# Altium project GD_Tcontroller_M.PrjPcb
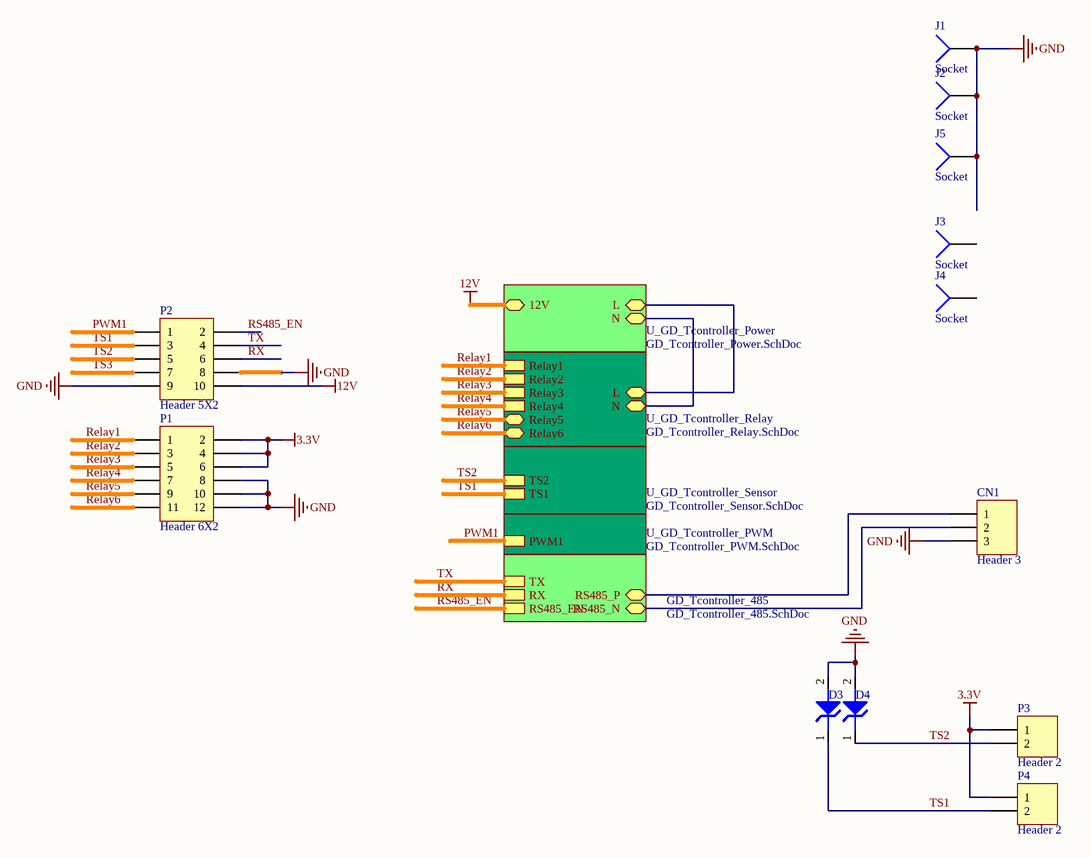
[diagram p0: GD_Tcontroller.SchDoc]
6 sheets, 83 parts. Net scope: hierarchical (ports join the sheet entries above them; power ports are global).
Board file: GD_Tcontroller_M.PcbDoc
Sheets:
  GD_Tcontroller.SchDoc
    GD_Tcontroller_485 = GD_Tcontroller_485.SchDoc
    U_GD_Tcontroller_Sensor = GD_Tcontroller_Sensor.SchDoc
    U_GD_Tcontroller_Relay = GD_Tcontroller_Relay.SchDoc
    U_GD_Tcontroller_PWM = GD_Tcontroller_PWM.SchDoc
    U_GD_Tcontroller_Power = GD_Tcontroller_Power.SchDoc

## Sheet GD_Tcontroller.SchDoc
size A4

### Parts
CN1  Header 3  [HT5.08-3P-H]
D3  SMAJ5.0A  [SMA]  (value not drawn)
D4  SMAJ5.0A  [SMA]  (value not drawn)
J1  Socket  [SCREWFG3_2]
J2  Socket  [SCREWFG3_2]
J3  Socket  [SCREWFG3_2]
J4  Socket  [SCREWFG3_2]
J5  Socket  [SCREWFG3_2]
P1  Header 6X2  [DC3-12P]
P2  Header 5X2  [DC3-10P]
P3  Header 2  [PH2.0-2P-H]
P4  Header 2  [PH2.0-2P-H]

### Sub-sheets
GD_Tcontroller_485 = GD_Tcontroller_485.SchDoc: RS485_EN, TX, RX, RS485_P, RS485_N
U_GD_Tcontroller_Power = GD_Tcontroller_Power.SchDoc: N, L, 12V
U_GD_Tcontroller_PWM = GD_Tcontroller_PWM.SchDoc: PWM1
U_GD_Tcontroller_Relay = GD_Tcontroller_Relay.SchDoc: Relay1, Relay2, Relay3, Relay4, Relay5, Relay6, L, N
U_GD_Tcontroller_Sensor = GD_Tcontroller_Sensor.SchDoc: TS1, TS2

### Nets
3.3V: P1.2 P1.4 P1.6 P3.1 P4.1
12V: P2.10 ; sheet U_GD_Tcontroller_Power/12V
GND: CN1.3 D3.2 D4.2 J1.1 J2.1 J5.1 P1.8 P1.10 P1.12 P2.8 P2.9
L: sheet U_GD_Tcontroller_Relay/L, sheet U_GD_Tcontroller_Power/L
N: sheet U_GD_Tcontroller_Relay/N, sheet U_GD_Tcontroller_Power/N
PWM1: P2.1 ; sheet U_GD_Tcontroller_PWM/PWM1
Relay1: P1.1 ; sheet U_GD_Tcontroller_Relay/Relay1
Relay2: P1.3 ; sheet U_GD_Tcontroller_Relay/Relay2
Relay3: P1.5 ; sheet U_GD_Tcontroller_Relay/Relay3
Relay4: P1.7 ; sheet U_GD_Tcontroller_Relay/Relay4
Relay5: P1.9 ; sheet U_GD_Tcontroller_Relay/Relay5
Relay6: P1.11 ; sheet U_GD_Tcontroller_Relay/Relay6
RS485_EN: P2.2 ; sheet GD_Tcontroller_485/RS485_EN
RS485_N: CN1.2 ; sheet GD_Tcontroller_485/RS485_N
RS485_P: CN1.1 ; sheet GD_Tcontroller_485/RS485_P
RX: P2.6 ; sheet GD_Tcontroller_485/RX
TS1: D3.1 P2.3 P4.2 ; sheet U_GD_Tcontroller_Sensor/TS1
TS2: D4.1 P2.5 P3.2 ; sheet U_GD_Tcontroller_Sensor/TS2
TS3: P2.7
TX: P2.4 ; sheet GD_Tcontroller_485/TX

Not connected (* = marked no-connect by the designer): J3 1; J4 1

### Library data of the parts
CN1 = Header 3: Header, 3-Pin; LatestRevisionDate: 17-Jul-2002; LatestRevisionNote: Re-released for DXP Platform.; Publisher: Altium Limited
D3 D4 = ED00032: Manufacturer P/N: SMBJ15A; Manufacturer: Bourns; P/N: EE00002; Value: SMBJ15A; Type: ****
P1 = Header 6X2: Header, 6-Pin, Dual row; LatestRevisionDate: 17-Jul-2002; LatestRevisionNote: Re-released for DXP Platform.; Publisher: Altium Limited
P2 = Header 5X2: Header, 5-Pin, Dual row; LatestRevisionDate: 17-Jul-2002; LatestRevisionNote: Re-released for DXP Platform.; Publisher: Altium Limited
P3 P4 = Header 2: Header, 2-Pin; LatestRevisionDate: 17-Jul-2002; LatestRevisionNote: Re-released for DXP Platform.; Publisher: Altium Limited
J1-J5 = Socket: LatestRevisionDate: 17-Jul-2002; LatestRevisionNote: Re-released for DXP Platform.; Publisher: Altium Limited

## Sheet GD_Tcontroller_485.SchDoc
size A4
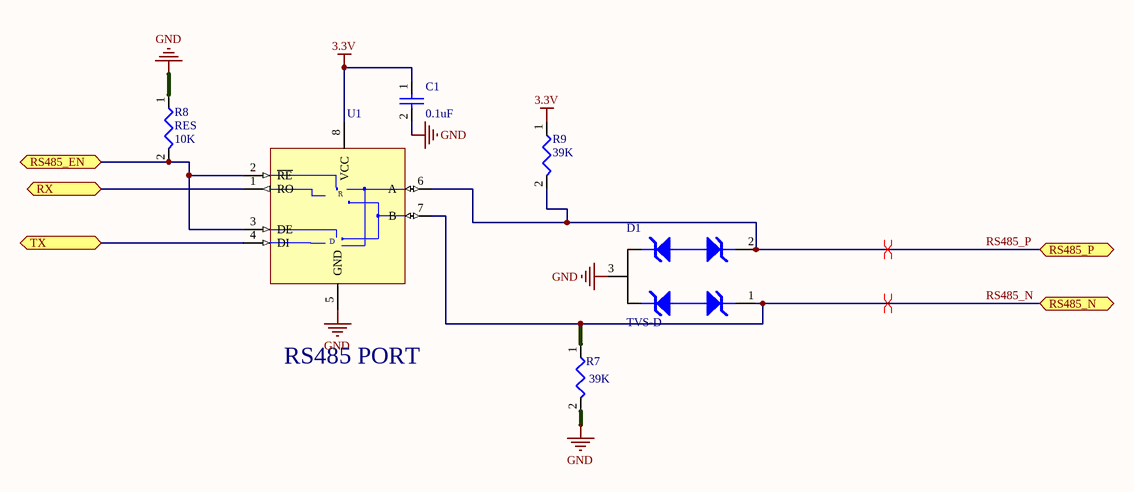
[diagram p1: GD_Tcontroller_485.SchDoc]

### Parts
C1  value 0.1uF  [C0805]  (hidden comment: CAP)
D1  TVS-D  [SOT23-123]
R7  value 39K  [R0805]  (hidden comment: RES)  (no BOM)
R8  RES  value 10K  [R0805]
R9  value 39K  [R0805]  (hidden comment: RES)  (no BOM)
U1  SN65HVD08D  [SOIC8]  (value not drawn)

### Ports
RS485_EN, RS485_N, RS485_P, RX, TX

### Nets
3.3V: C1.1 R9.1 U1.8(VCC)
GND: C1.2 D1.3 R7.2 R8.1 U1.5(GND)
RS485_EN: R8.2 U1.2(~{RE}) U1.3(DE) ; port RS485_EN
RS485_N: D1.1 R7.1 U1.7(B) ; port RS485_N
RS485_P: D1.2 R9.2 U1.6(A) ; port RS485_P
RX: U1.1(RO) ; port RX
TX: U1.4(DI) ; port TX

### Layout directives
differential pair: RS485_N, RS485_P

### Notes on the sheet
- RS485 PORT
- (in symbol EU00041) R; D

### Library data of the parts
C1 = EC00014: CAP SMD CR X7R 50V 10% 0.1uF 0805 ROHS; Manufacturer: YAGEO; Manufacturer P/N: CC0805KRX7R9BB104; ID: 14; HelpURL: *; P/N: EC00014
D1 = ED00007: DIODE TVS 7V 12V 17A 400W SOT-23 SMD ROHS; Manufacturer: BOURNS; ID: 7; Value: CDSOT23-SM712; Type: ****; HelpURL: \\192.168.1.3\Esh\Department\RD\CAD\Component\IO_PROTECTION\BOURNS_CDSOT23-SM712.pdf; P/N: ED00007; Manufacturer P/N: CDSOT23-SM712
R7 R9 = ER00021: RES THICK_FILM SMD 39K 5% 1/8W ROHS 0805; Manufacturer: YAGEO; Manufacturer P/N: RC0805JR-0739KL; ID: 21; HelpURL: *; P/N: ER00021
R8 = ER00213: RES THICK_FILM SMD 10K ohm 5% 1/10W ROHS 0603; Manufacturer: YAGEO; Manufacturer P/N: RC0603JR-1310KL; ID: 213; HelpURL: \\192.168.1.3\Esh\Department\RD\CAD\Component\Resistor\SMD\YAGEO_PYu-RC1206_51_RoHS_L_4.pdf; P/N: ER00213
U1 = EU00041: IC 5V,RS-485,10Mbps,16KV,TRANSCEIVERS,SOIC-8,ROHS; Manufacturer: Texas Instruments; ID: 41; HelpURL: \\192.168.1.3\Esh\Department\RD\CAD\Component\RS485\sn65hvd08.pdf; P/N: EU00041; Manufacturer P/N: SN65HVD08D; Value: SN65HVD08D; Type: *****

## Sheet GD_Tcontroller_Sensor.SchDoc
size A4
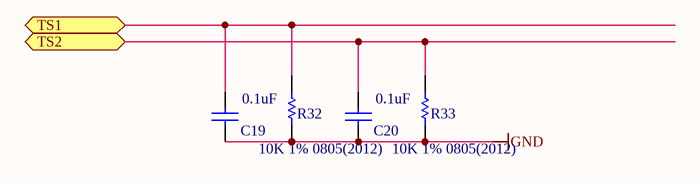
[diagram p2: GD_Tcontroller_Sensor.SchDoc]

### Parts
C19  value 0.1uF  [C0805]  (hidden comment: CAP 0.1uF 50V 0805(2012))
C20  value 0.1uF  [C0805]  (hidden comment: CAP 0.1uF 50V 0805(2012))
R32  10K 1% 0805(2012)  [R0805]  (no BOM)
R33  10K 1% 0805(2012)  [R0805]  (no BOM)

### Ports
TS1, TS2

### Nets
GND: C19.1 C20.1 R32.2 R33.2
TS1: C19.2 R32.1 ; port TS1
TS2: C20.2 R33.1 ; port TS2

### Library data of the parts
C19 C20 = CMP-1036-00070-1: CAP 0.1uF 50V ±20% 0805 (2012 Metric) Thickness 1mm SMD; Case-Metric: 2012; Case-EIA: 0805; Tolerance: 20%; Rated Voltage: 50 V; Technology: SMT; Max Thickness: 1 mm
R32 R33 = CMP-1013-00098-1: 10K 0.125W 5% 0805 (2012 Metric)  SMD; Case-EIA: 0805; Case-Metric: 2012; Value: 10000.00 Ohm; Power: 0.125 W; Technology: SMT; Tolerance: 1 %

## Sheet GD_Tcontroller_Relay.SchDoc
size A3
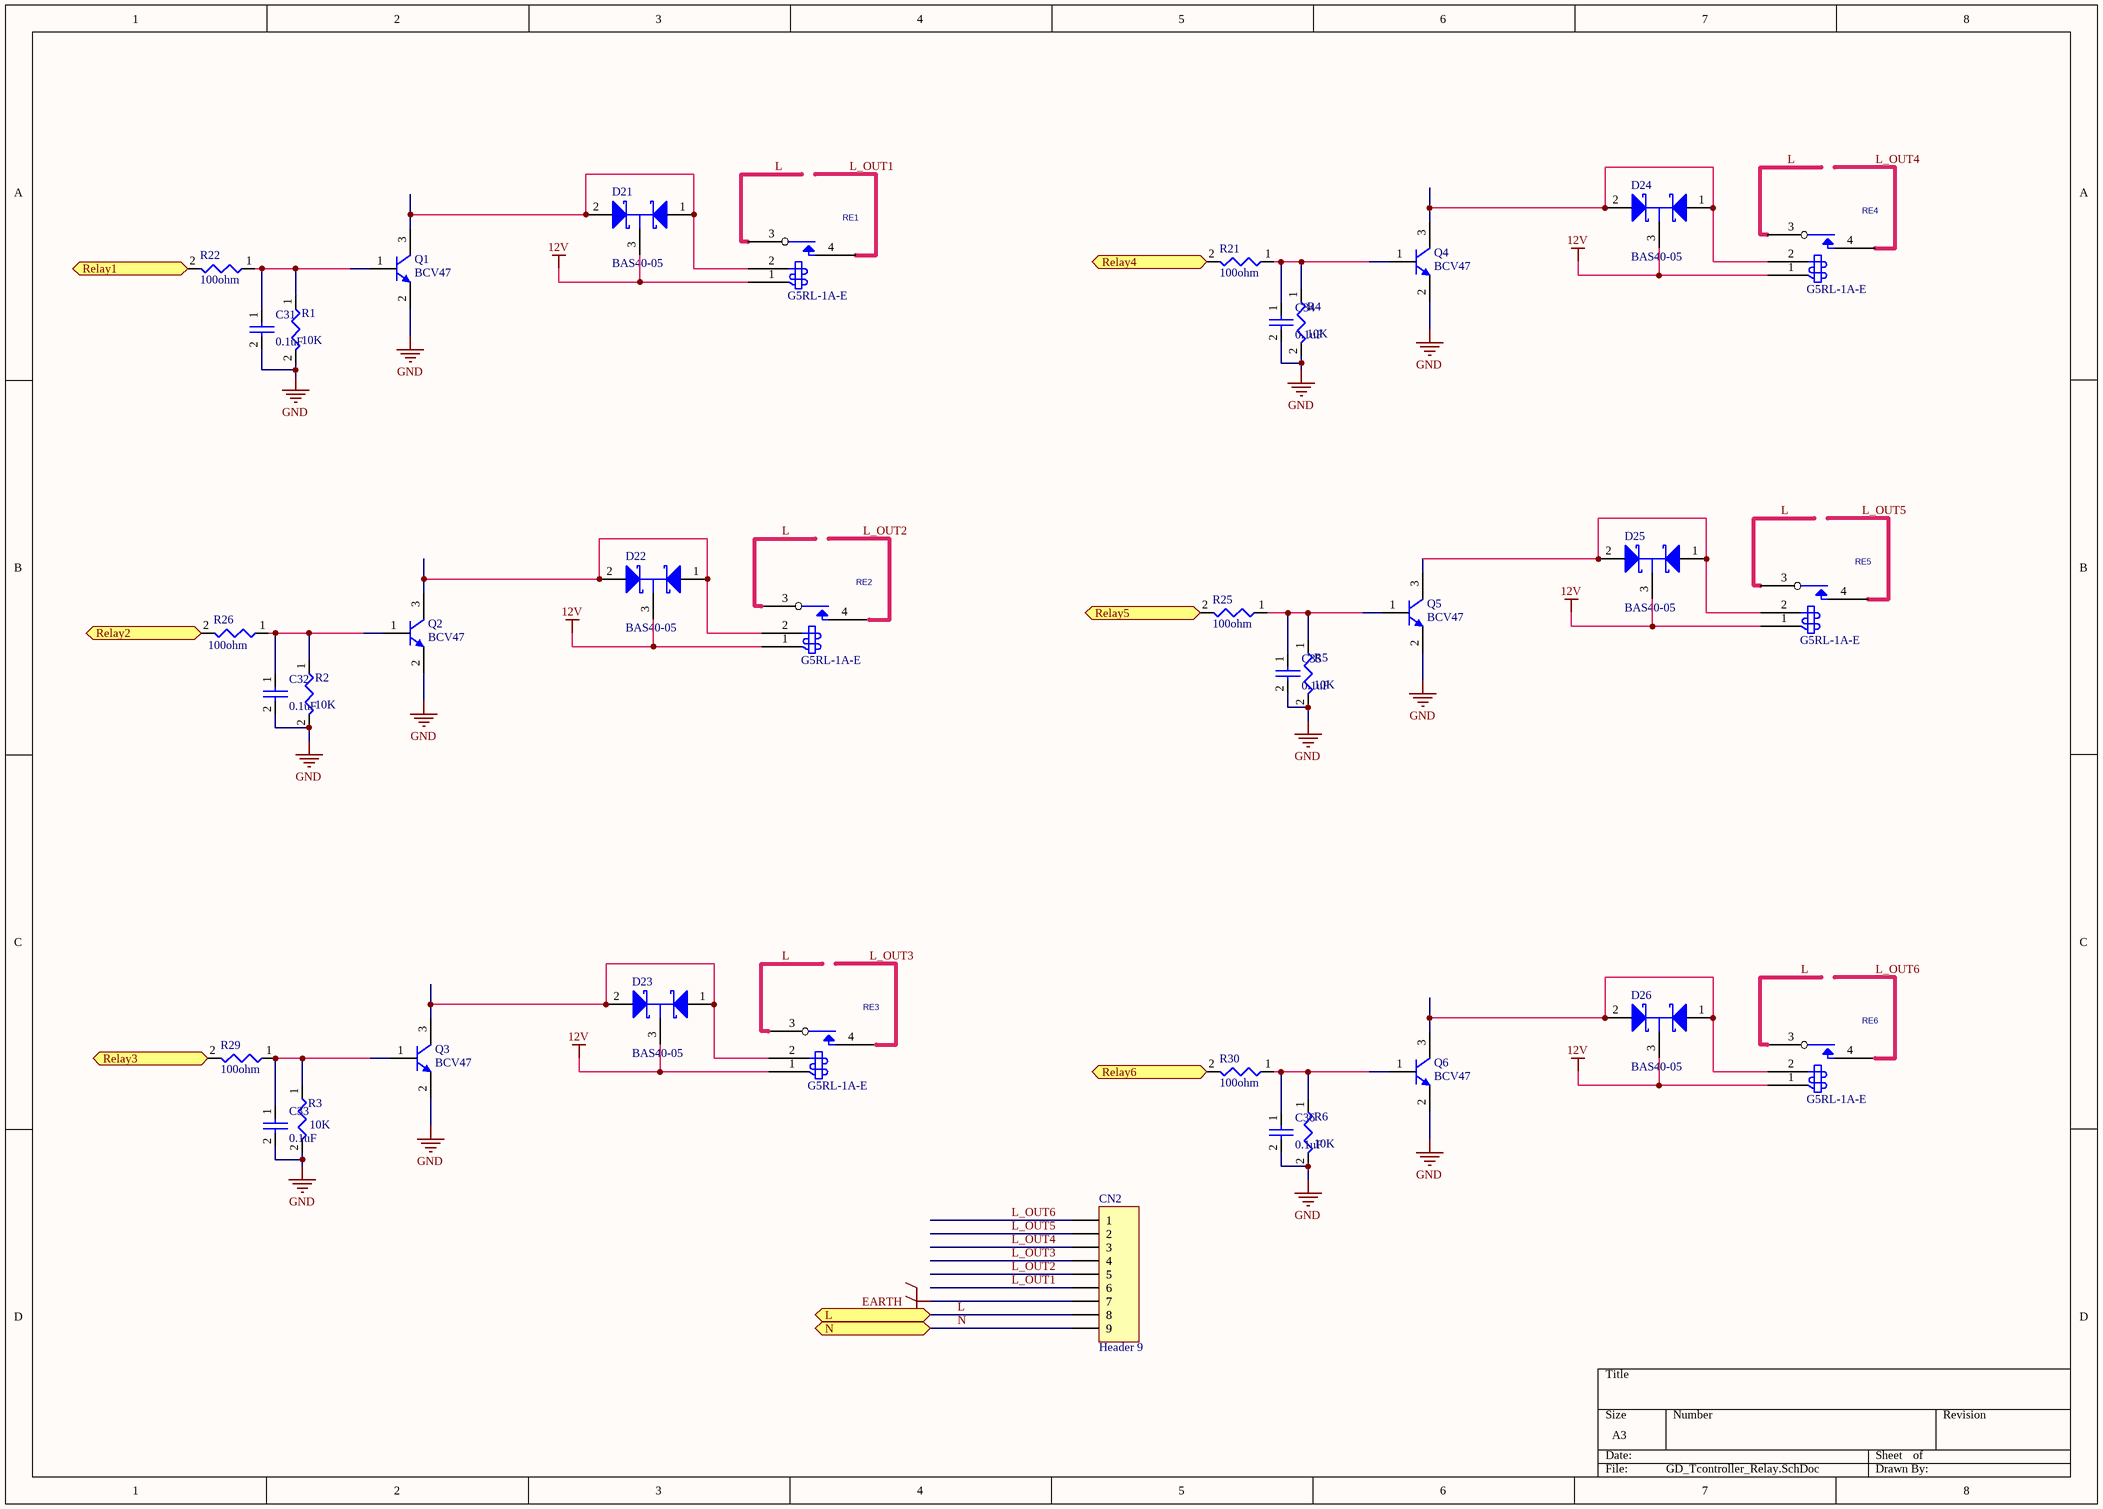
[diagram p3: GD_Tcontroller_Relay.SchDoc]

### Parts
C31  value 0.1uF  [C0805]  (hidden comment: CAP)
C32  value 0.1uF  [C0805]  (hidden comment: CAP)
C33  value 0.1uF  [C0805]  (hidden comment: CAP)
C34  value 0.1uF  [C0805]  (hidden comment: CAP)
C35  value 0.1uF  [C0805]  (hidden comment: CAP)
C36  value 0.1uF  [C0805]  (hidden comment: CAP)
CN2  Header 9  [KF7.62-9P]
D21  BAS40-05  [SOT23-123]
D22  BAS40-05  [SOT23-123]
D23  BAS40-05  [SOT23-123]
D24  BAS40-05  [SOT23-123]
D25  BAS40-05  [SOT23-123]
D26  BAS40-05  [SOT23-123]
Q1  BCV47  [INF-SOT23_L]
Q2  BCV47  [INF-SOT23_L]
Q3  BCV47  [INF-SOT23_L]
Q4  BCV47  [INF-SOT23_L]
Q5  BCV47  [INF-SOT23_L]
Q6  BCV47  [INF-SOT23_L]
R1  value 10K  [R0805]
R2  value 10K  [R0805]
R3  value 10K  [R0805]
R4  value 10K  [R0805]
R5  value 10K  [R0805]
R6  value 10K  [R0805]
R21  value 100ohm  [R0805]  (hidden comment: RES)
R22  value 100ohm  [R0805]  (hidden comment: RES)
R25  value 100ohm  [R0805]  (hidden comment: RES)
R26  value 100ohm  [R0805]  (hidden comment: RES)
R29  value 100ohm  [R0805]  (hidden comment: RES)
R30  value 100ohm  [R0805]  (hidden comment: RES)
RE1  RELAY SP  [G5RL-1A-E]  (value not drawn)
RE2  RELAY SP  [G5RL-1A-E]  (value not drawn)
RE3  RELAY SP  [G5RL-1A-E]  (value not drawn)
RE4  RELAY SP  [G5RL-1A-E]  (value not drawn)
RE5  RELAY SP  [G5RL-1A-E]  (value not drawn)
RE6  RELAY SP  [G5RL-1A-E]  (value not drawn)

### Ports
L, N, Relay1, Relay2, Relay3, Relay4, Relay5, Relay6

### Nets
12V: D21.3(C) D22.3(C) D23.3(C) D24.3(C) D25.3(C) D26.3(C) RE1.1(COIL) RE2.1(COIL) RE3.1(COIL) RE4.1(COIL) RE5.1(COIL) RE6.1(COIL)
EARTH: CN2.7
GND: C31.2 C32.2 C33.2 C34.2 C35.2 C36.2 Q1.2(E) Q2.2(E) Q3.2(E) Q4.2(E) Q5.2(E) Q6.2(E) R1.2 R2.2 R3.2 R4.2 R5.2 R6.2
L: CN2.8 RE1.3(COMMON) RE2.3(COMMON) RE3.3(COMMON) RE4.3(COMMON) RE5.3(COMMON) RE6.3(COMMON) ; port L
L_OUT1: CN2.6 RE1.4(NO)
L_OUT2: CN2.5 RE2.4(NO)
L_OUT3: CN2.4 RE3.4(NO)
L_OUT4: CN2.3 RE4.4(NO)
L_OUT5: CN2.2 RE5.4(NO)
L_OUT6: CN2.1 RE6.4(NO)
N: CN2.9 ; port N
Relay1: R22.2 ; port Relay1
Relay2: R26.2 ; port Relay2
Relay3: R29.2 ; port Relay3
Relay4: R21.2 ; port Relay4
Relay5: R25.2 ; port Relay5
Relay6: R30.2 ; port Relay6
NetC31_1: C31.1 Q1.1(B) R1.1 R22.1
NetC32_1: C32.1 Q2.1(B) R2.1 R26.1
NetC33_1: C33.1 Q3.1(B) R3.1 R29.1
NetC34_1: C34.1 Q4.1(B) R4.1 R21.1
NetC35_1: C35.1 Q5.1(B) R5.1 R25.1
NetC36_1: C36.1 Q6.1(B) R6.1 R30.1
NetD21_1: D21.1(A) D21.2(K) Q1.3(C) RE1.2(COIL)
NetD22_1: D22.1(A) D22.2(K) Q2.3(C) RE2.2(COIL)
NetD23_1: D23.1(A) D23.2(K) Q3.3(C) RE3.2(COIL)
NetD24_1: D24.1(A) D24.2(K) Q4.3(C) RE4.2(COIL)
NetD25_1: D25.1(A) D25.2(K) Q5.3(C) RE5.2(COIL)
NetD26_1: D26.1(A) D26.2(K) Q6.3(C) RE6.2(COIL)

### Library data of the parts
C31-C36 = EC00014: as C1 on sheet GD_Tcontroller_485; HelpURL: *; P/N: EC00014
CN2 = Header 9: Header, 9-Pin
D21-D26 = ED00044: DIODE Schottky Diode 40V 0.2A SOT-23 SMD ROHS; Manufacturer: NXP; ID: 44; Value: BAS40-05-V; Type: ****; HelpURL: \\192.168.1.3\Esh\Department\RD\CAD\Component\DIODE\BAS40_1PSXXSB4X_SER.pdf; P/N: ED00044; Manufacturer P/N: BAS40-05
Q1-Q6 = CMP-1196-00014-1: NPN Silicon Darlington Transistor, 60 V VCEO, 500 mA IC, SOT23, Reel, Green; Manufacturer: Infineon; fT (typ): 170 MHz; IC (max): 500 mA; ICBO (max): 10 uA; Green: TRUE; VCE: 5 V; hFE (min): 2000; ICM (max): 800 mA; VCBO (max): 80 V; IC: 100 mA; VCEO (max): 60 V; VEBO (max): 10 V; ComponentLink1URL: http://www.infineon.com/; PackageVersion: Apr-08; ComponentLink2URL: http://www.infineon.com/dgdl/bcv27_bcv47.pdf?folderId=db3a30431441fb5d011445c30f210183&fileId=db3a30431441fb5d011445cf7c3b0188; ComponentLink2Description: Datasheet; ComponentLink1Description: Manufacturer URL; PartNumber: BCV47; Polarity: NPN; PackageReference: SOT23; PackageDescription: 3-Pin Small Outline Transistor Package, 1.3 x 2.9 mm Body, 0.95 mm Pitch; ComponentLink3URL: http://www.infineon.com/dgdl/SOT23-Package_Overview.pdf?folderId=db3a30431936bc4b0119532290053c66&fileId=db3a30431936bc4b0119533468123c85; Mounting Technology: Surface Mount; Packing: Reel; ComponentLink3Description: Package Specification
R1-R6 = ER00213: as R8 on sheet GD_Tcontroller_485; HelpURL: \\192.168.1.3\Esh\Department\RD\CAD\Component\Resistor\SMD\YAGEO_PYu-RC1206_51_RoHS_L_4.pdf; P/N: ER00213
R21 R22 R25 R26 R29 R30 = ER00035: RES THICK_FILM SMD 100 OHM 5% 1/8W ROHS 0805; Manufacturer: YAGEO; Manufacturer P/N: RC0805JR-07100RL; ID: 35; HelpURL: *; P/N: ER00035
RE1-RE6 = EK00005: Relay,12VDC,16A,250VAC; Manufacturer: OMRON; Value: Relay 16A; ID: 5; HelpURL: \\192.168.1.3\Esh\Department\RD\CAD\Component\relay\OMRON\G5RL_0609.pdf; P/N: EK00005; Manufacturer P/N: G5RL-1A-E; Type: *****

## Sheet GD_Tcontroller_PWM.SchDoc
size A4
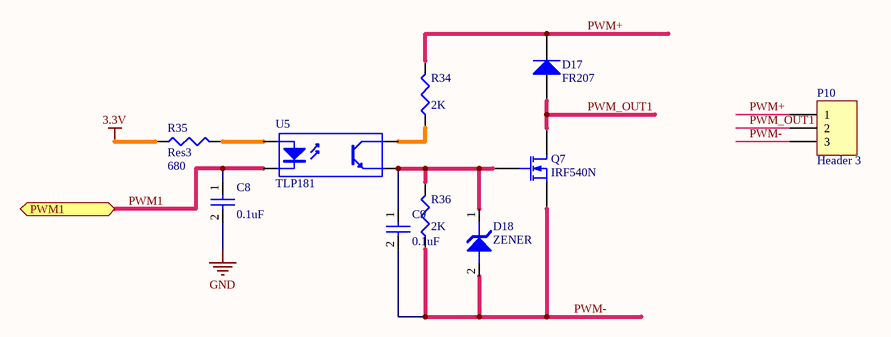
[diagram p4: GD_Tcontroller_PWM.SchDoc]

### Parts
C8  value 0.1uF  [C0805]  (hidden comment: CAP)
C9  value 0.1uF  [C0805]  (hidden comment: CAP)
D17  FR207  [ONSC-AXIAL_LEAD-2-59AA-01_P]
D18  ZENER  [SMB]
P10  Header 3  [HT5.08-3P-H]
Q7  IRF540N  [ONSC-TO-220-3-221A-09_AF]
R34  value 2K  [R1206]  (hidden comment: Res3)
R35  Res3  value 680  [R1206]
R36  value 2K  [R1206]  (hidden comment: Res3)
U5  TLP181  [TLP181]

### Ports
PWM1

### Nets
3.3V: R35.1
GND: C8.2
PWM1: C8.1 U5.2(K) ; port PWM1
PWM+: D17.2(K) P10.1 R34.2
PWM-: C9.2 D18.2 P10.3 Q7.3(S) R36.1
PWM_OUT1: D17.1(A) P10.2 Q7.1(D)
NetC9_1: C9.1 D18.1 Q7.2(G) R36.2 U5.3(E)
NetR34_1: R34.1 U5.4(C)
NetR35_2: R35.2 U5.1(A)

### Library data of the parts
C8 C9 = EC00014: as C1 on sheet GD_Tcontroller_485; HelpURL: *; P/N: EC00014
D17 = Diode: Default Diode; Published: 8-Jun-2000; LatestRevisionDate: 17-Jul-2002; LatestRevisionNote: Re-released for DXP Platform.; PackageVersion: Sep-1996; PackageReference: SMC; Publisher: Altium Limited; PackageDescription: DO-214-AB/SMC; 2 C-Bend Leads; Body 7.9 x 5.9 mm, inc. leads (LxW); Code_JEDEC: DO-214-AB
D18 = ED00032: as D3 on sheet GD_Tcontroller
P10 = Header 3: Header, 3-Pin; LatestRevisionDate: 17-Jul-2002; LatestRevisionNote: Re-released for DXP Platform.; Publisher: Altium Limited
Q7 = MOSFET-N: N-Channel MOSFET; Published: 8-Jun-2000; LatestRevisionDate: 17-Jul-2002; LatestRevisionNote: Re-released for DXP Platform.; PackageVersion: 1995/1996; PackageReference: E3; Publisher: Altium Limited; PackageDescription: TO, Flat Index; 3 In-Line, Axial Leads; Body Dia. 4.6mm; Lead Dia. 0.5 mm (max)
R34-R36 = Res3: Resistor; Published: 8-Jun-2000; LatestRevisionDate: 29-May-2009; LatestRevisionNote: IPC-7351 Footprint Added.; PackageReference: J1-0603; Publisher: Altium Limited; PackageDescription: Chip Resistor
U5 = Optoisolator1: 4-Pin Phototransistor Optocoupler; Published: 24-Mar-1999; LatestRevisionDate: 04-Mar-2005; LatestRevisionNote: Sch pins 3 & 4 Swapped.; DatasheetVersion: Nov-2003; PackageReference: DIP-4; Publisher: Altium Limited

## Sheet GD_Tcontroller_Power.SchDoc
size A4
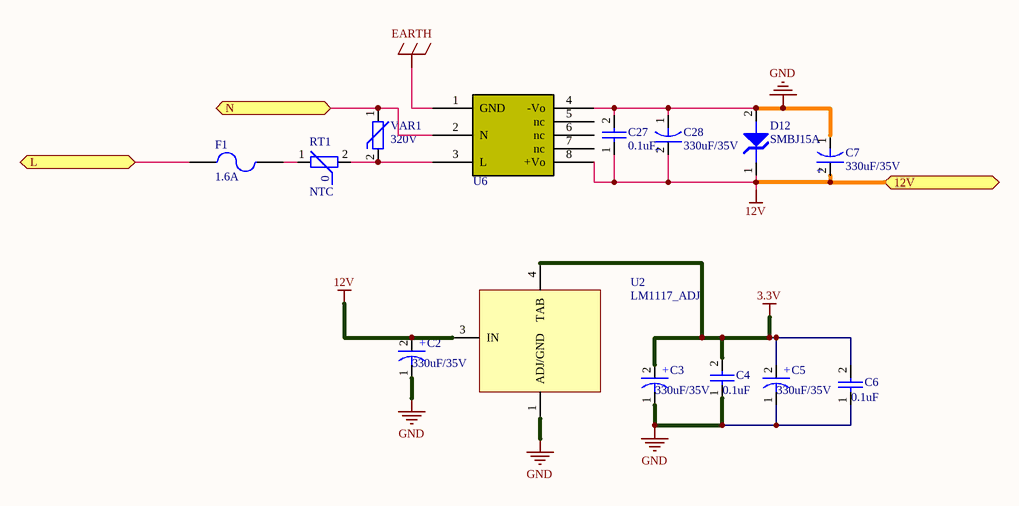
[diagram p5: GD_Tcontroller_Power.SchDoc]

### Parts
C2  value 330uF/35V  [CA10X16P5]  (hidden comment: CAPACITOR)
C3  value 330uF/35V  [CA10X16P5]  (hidden comment: CAPACITOR)
C4  value 0.1uF  [C0805]  (hidden comment: CAP)
C5  value 330uF/35V  [CA10X16P5]  (hidden comment: CAPACITOR)
C6  value 0.1uF  [C0805]  (hidden comment: CAP)
C7  value 330uF/35V  [CA10X16P5]  (hidden comment: CAPACITOR)
C27  value 0.1uF  [C0805]  (hidden comment: CAP)
C28  value 330uF/35V  [CA10X16P5]  (hidden comment: CAPACITOR)
D12  SMBJ15A  [SMB]
F1  value 1.6A  [392XXXX000]  (hidden comment: Fuse)
RT1  NTC  [NTC8_5x6P5]
U2  LM1117_ADJ  [DPAK-134]
U6  LH05-10B12  [LH05X]  (value not drawn)
VAR1  value 320V  [VAR16_7X6_6P7_5]  (hidden comment: VARISTOR)

### Ports
12V, L, N

### Nets
3.3V: C3.2 C4.2 C5.2 C6.2 U2.4(TAB)
12V: C2.2 C7.2 C27.1 C28.2 D12.1 U2.3(IN) U6.8(+Vo) ; port 12V
EARTH: U6.1(GND)
GND: C2.1 C3.1 C4.1 C5.1 C6.1 C7.1 C27.2 C28.1 D12.2 U2.1(ADJ/GND) U6.4(-Vo)
L: F1.1 ; port L
N: U6.2(N) VAR1.1 ; port N
NetF1_2: F1.2 RT1.1
NetRT1_2: RT1.2 U6.3(L) VAR1.2

Not connected (* = marked no-connect by the designer): U6 5(nc) 6(nc) 7(nc)

### Notes on the sheet
- (in symbol EC00095) +
- (in symbol EF00003) 0

### Library data of the parts
C2 C3 C5 C7 C28 = EC00095: CAP 35V 20% 330uF 10X16X0.6MM ROHS，7000hours; Manufacturer: NIPPON CHEMI-CON; Manufacturer P/N: EKY350ELL331MJ16S; ID: 95; Type: ****; HelpURL: \\192.168.1.3\Esh\Department\RD\CAD\Component\Capacitor\KY(105).pdf; P/N: EC00095
C4 C6 C27 = EC00014: as C1 on sheet GD_Tcontroller_485; HelpURL: *; P/N: EC00014
D12 = ED00032: Manufacturer: Bourns; P/N: EE00002; Type: ****; Manufacturer P/N: SMBJ15A; Value: SMBJ15A
F1 = EF00005: FUSE,Ceramic,1.6A,25A@250VAC,8.5x8mm,ROHS; Manufacturer: LITTELFUSE; Manufacturer P/N: 39211600440; ID: 5; Type: ****; HelpURL: \\192.168.1.3\Esh\Department\RD\CAD\Component\Fuse\Ltitelfuse_Fuse_392.pdf; P/N: EF00005
RT1 = EF00003: Manufacturer P/N: 5D2-08LD; Manufacturer: SEMITEC; P/N: EE00003; Value: 5 Ohm  3A
U2 = EU00066: IC REG VOLT +3.3V LDO 800MA DPAK ROHS; Manufacturer P/N: LD1117DT33TR; Manufacturer: ST; ID: 66; Value: LD1117-3.3; P/N: EU00066; HelpURL: \\192.168.1.3\Esh\Department\RD\CAD\Component\Power_DC_to_DC\LD1117_ST.pdf; Type: *****
U6 = LH05-10B05: Manufacturer: Mornsun; P/N: EE00001; Manufacturer P/N: LH05-10B05
VAR1 = ER00200: MOV 320V 14MM 80J LDFR ROHS; Manufacturer: LITTELFUSE; Manufacturer P/N: V320LA20AP; ID: 200; HelpURL: \\192.168.1.3\Esh\Department\RD\CAD\Component\Resistor\Varistor\Littelfuse_MOV_LA.pdf; P/N: ER00200; Type: ****

## Nets that join several sheets
3.3V: GD_Tcontroller (5 pins), GD_Tcontroller_485 (C1.1 R9.1 U1.8), GD_Tcontroller_PWM (R35.1), GD_Tcontroller_Power (5 pins)
12V: GD_Tcontroller (P2.10), GD_Tcontroller_Relay (12 pins), GD_Tcontroller_Power (7 pins)
EARTH: GD_Tcontroller_Relay (CN2.7), GD_Tcontroller_Power (U6.1)
GND: GD_Tcontroller (11 pins), GD_Tcontroller_485 (5 pins), GD_Tcontroller_Sensor (C19.1 C20.1 R32.2 R33.2), GD_Tcontroller_Relay (18 pins), GD_Tcontroller_PWM (C8.2), GD_Tcontroller_Power (11 pins)
L: GD_Tcontroller_Relay (7 pins), GD_Tcontroller_Power (F1.1)
N: GD_Tcontroller_Relay (CN2.9), GD_Tcontroller_Power (U6.2 VAR1.1)
PWM1: GD_Tcontroller (P2.1), GD_Tcontroller_PWM (C8.1 U5.2)
Relay1: GD_Tcontroller (P1.1), GD_Tcontroller_Relay (R22.2)
Relay2: GD_Tcontroller (P1.3), GD_Tcontroller_Relay (R26.2)
Relay3: GD_Tcontroller (P1.5), GD_Tcontroller_Relay (R29.2)
Relay4: GD_Tcontroller (P1.7), GD_Tcontroller_Relay (R21.2)
Relay5: GD_Tcontroller (P1.9), GD_Tcontroller_Relay (R25.2)
Relay6: GD_Tcontroller (P1.11), GD_Tcontroller_Relay (R30.2)
RS485_EN: GD_Tcontroller (P2.2), GD_Tcontroller_485 (R8.2 U1.2 U1.3)
RS485_N: GD_Tcontroller (CN1.2), GD_Tcontroller_485 (D1.1 R7.1 U1.7)
RS485_P: GD_Tcontroller (CN1.1), GD_Tcontroller_485 (D1.2 R9.2 U1.6)
RX: GD_Tcontroller (P2.6), GD_Tcontroller_485 (U1.1)
TS1: GD_Tcontroller (D3.1 P2.3 P4.2), GD_Tcontroller_Sensor (C19.2 R32.1)
TS2: GD_Tcontroller (D4.1 P2.5 P3.2), GD_Tcontroller_Sensor (C20.2 R33.1)
TX: GD_Tcontroller (P2.4), GD_Tcontroller_485 (U1.4)